# EasyEDA Pro project ProPrj_C64 Printer Interface_2025-09-17.epro

# Schematic Schematic1
Board Name: Board1; Create Date: 2025-08-26; Page Name: P1; Project Name: C64 Printer Interface; Schematic Name: Schematic1; Update Date: 2025-09-10; Company: EasyEDA.com; Page Size: A4; Version: V1.0
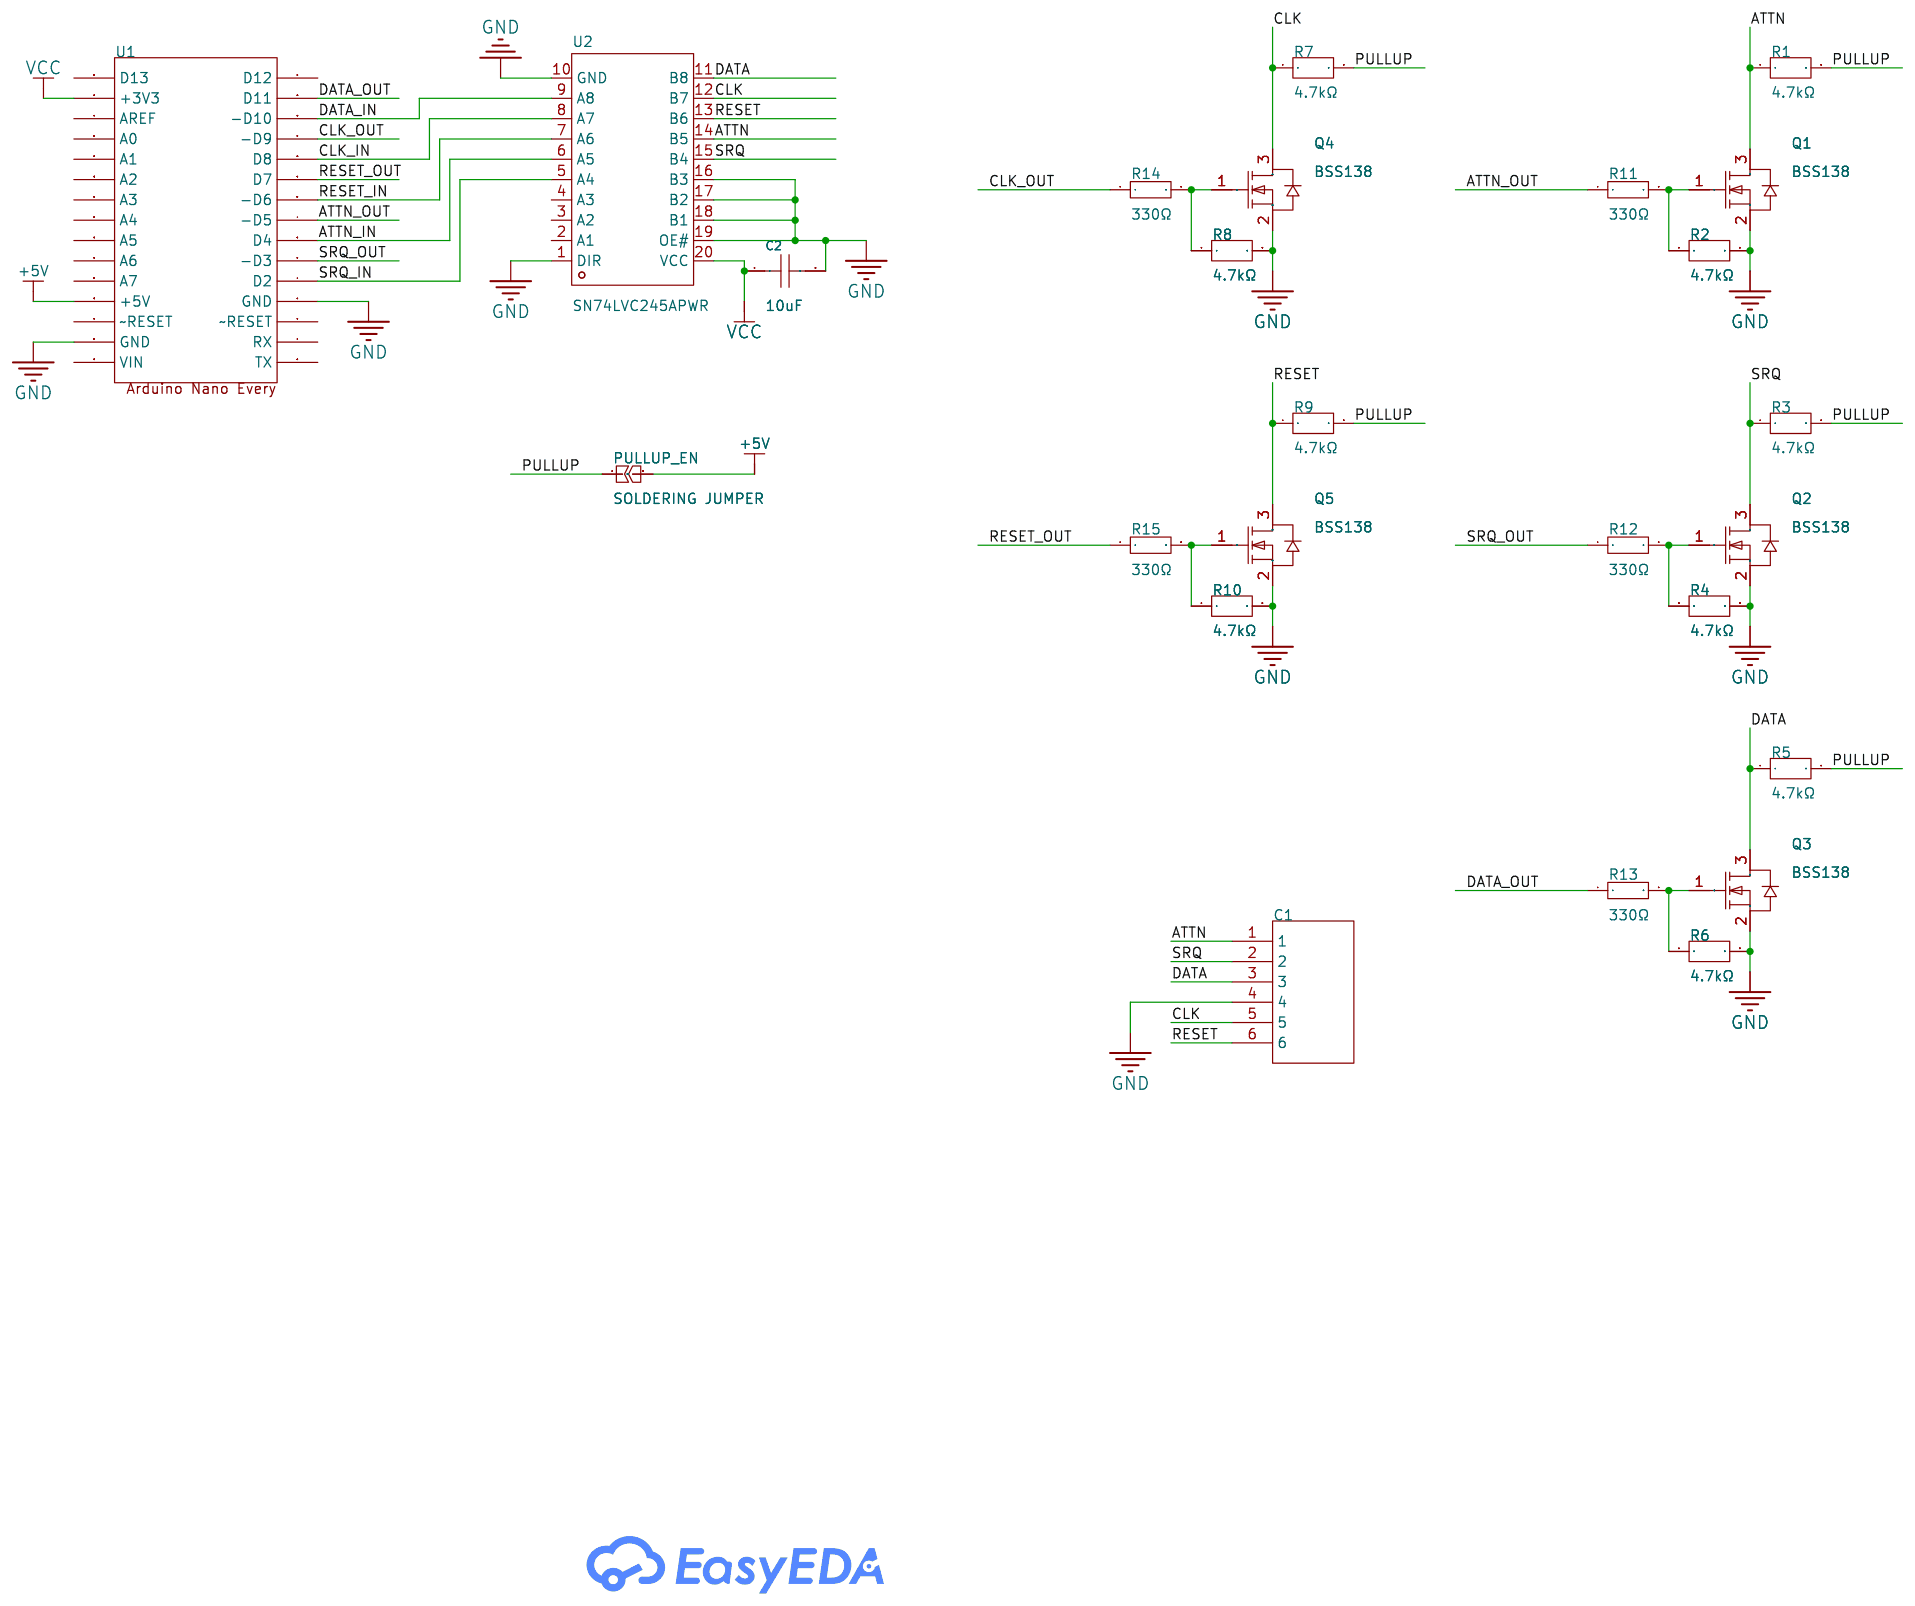
[diagram p0: schematic sheet]

## Parts
C1  DIN 6  [FC680806]
C2  10uF  [C0603]
PULLUP_EN  SOLDERING JUMPER  [JUMPER]
Q1  BSS138  [SOT-23_L2.9-W1.3-P1.90-LS2.4-BR]
Q2  BSS138  [SOT-23_L2.9-W1.3-P1.90-LS2.4-BR]
Q3  BSS138  [SOT-23_L2.9-W1.3-P1.90-LS2.4-BR]
Q4  BSS138  [SOT-23_L2.9-W1.3-P1.90-LS2.4-BR]
Q5  BSS138  [SOT-23_L2.9-W1.3-P1.90-LS2.4-BR]
R1  4.7kΩ  [R0805]
R2  4.7kΩ  [R0805]
R3  4.7kΩ  [R0805]
R4  4.7kΩ  [R0805]
R5  4.7kΩ  [R0805]
R6  4.7kΩ  [R0805]
R7  4.7kΩ  [R0805]
R8  4.7kΩ  [R0805]
R9  4.7kΩ  [R0805]
R10  4.7kΩ  [R0805]
R11  330Ω  [R0603]
R12  330Ω  [R0603]
R13  330Ω  [R0603]
R14  330Ω  [R0603]
R15  330Ω  [R0603]
U1  -  [Arduino Nano Every (SMD)]
U2  SN74LVC245APWR  [TSSOP-20_L6.5-W4.4-P0.65-LS6.4-BL]

## Library data of the parts
C1 = FC680806 DIN 6 240°
C2 = CL10A106MA8NRNC: Capacitance:10uF Tolerance:±20% Tolerance:±20% Voltage Rating:25V Temperature Coefficient:X5R; LCSC Part Name: 10uF ±20% 25V; Supplier Part: C96446; Manufacturer: SAMSUNG(三星); Supplier Footprint: 0603; JLCPCB Part Class: Basic Part; Datasheet: https://item.szlcsc.com/datasheet/CL10A106MA8NRNC/97651.html; Supplier: LCSC; Tolerance: ±20%; Voltage Rating: 25V; Temperature Coefficient: X5R
PULLUP_EN = Jumper 3pin
Q1-Q5 = BSS138_C2938375: Number:1 N-Channel Drain to Source Voltage:50V Current - Continuous Drain(Id):220mA RDS(on):1.7Ω@10V；6Ω@4.5V Pd - Power Dissipation:350mW Gate Threshold Voltage (Vgs(th)):1.5V@1mA Gate Charge(Qg):- Input Capacitance(Ciss):27pF Reverse Transfer Capacitance; LCSC Part Name: 1个N沟道 耐压:50V 电流:220mA; Supplier Part: C2938375; Manufacturer: GOODWORK(固得沃克); Supplier Footprint: SOT-23; JLCPCB Part Class: Extended Part; Datasheet: https://item.szlcsc.com/datasheet/BSS138/3294712.html; Supplier: LCSC; Number: 1 N-Channel; Drain to Source Voltage: 50V; Current - Continuous Drain(Id): 220mA; RDS(on): 1.7Ω@10V；6Ω@4.5V; Pd - Power Dissipation: 350mW; Gate Threshold Voltage (Vgs(th)): 1.5V@1mA; Input Capacitance(Ciss): 27pF; Reverse Transfer Capacitance (Crss@Vds): 6pF; Operating Temperature: -55℃~+150℃@(Tj); Type: N-Channel; Output Capacitance(Coss): 13pF
R1-R10 = ERJ6RBD4701V: Type:Thick Film Resistors Resistance:4.7kΩ Tolerance:±0.5% Tolerance:±0.5% Power(Watts): Overload Voltage (Max): Temperature Coefficient:±50ppm/℃ Temperature Coefficient:±50ppm/℃ Operating Temperature Range:-55℃~+155℃ Operating Temperature Range:-55℃~+155; LCSC Part Name: 4.7kΩ ±0.5% 100mW 厚膜电阻; Supplier Part: C336873; Manufacturer: PANASONIC(松下); Supplier Footprint: 0805; JLCPCB Part Class: Extended Part; Datasheet: https://atta.szlcsc.com/upload/public/pdf/source/20190227/C336873_CFE7B4490CD09E0892B850DE1394AEF8.pdf; Supplier: LCSC; Type: Thick Film Resistors; Tolerance: ±0.5%; Temperature Coefficient: ±50ppm/℃; Operating Temperature Range: -55℃~+155℃
R11-R15 = 0603WAF3300T5E: Type:Thick Film Resistors Resistance: Tolerance:±1% Tolerance:±1% Power(Watts): Overload Voltage (Max): Temperature Coefficient:±100ppm/℃ Temperature Coefficient:±100ppm/℃ Operating Temperature Range:-55℃~+155℃ Operating Temperature Range:-55℃~+155℃; LCSC Part Name: 330Ω ±1% 100mW 厚膜电阻; Supplier Part: C23138; Manufacturer: UNI-ROYAL(厚声); Supplier Footprint: 0603; JLCPCB Part Class: Basic Part; Datasheet: https://atta.szlcsc.com/upload/public/pdf/source/20200306/C422600_1E6D84923E4A46A82E41ADD87F860B5C.pdf; Supplier: LCSC; Type: Thick Film Resistors; Tolerance: ±1%; Temperature Coefficient: ±100ppm/℃; Operating Temperature Range: -55℃~+155℃
U1 = Arduino Nano Every
U2 = SN74LVC245APWR: output type:Tri-State Voltage - Supply:1.65V~3.6V Voltage - Supply:1.65V~3.6V Number of Elements:1 Number of Bits per Element:8 Current - Output Low(IOL):24mA Current - Output High(IOH):24mA Logic Family:74LVC Operating Temperature:-40℃~+125℃ Operating Te; Supplier Part: C7848; Manufacturer: TI(德州仪器); Supplier Footprint: TSSOP-20; JLCPCB Part Class: Extended Part; Datasheet: https://www.ti.com/cn/lit/gpn/sn74lvc245a; Supplier: LCSC; output type: Tri-State; Voltage - Supply: 1.65V~3.6V; Number of Elements: 1; Number of Bits per Element: 8; Current - Output Low(IOL): 24mA; Current - Output High(IOH): 24mA; Logic Family: 74LVC; Operating Temperature: -40℃~+125℃

## Nets
+5V: PULLUP_EN.2 U1.26(+5V)
GND: C1.4 C2.2 Q1.2(S) Q2.2(S) Q3.2(S) Q4.2(S) Q5.2(S) R2.2 R4.2 R6.2 R8.2 R10.2 U1.3(GND) U1.28(GND) U2.1(DIR) U2.10(GND) U2.16(B3) U2.17(B2) U2.18(B1) U2.19(OE#)
VCC: C2.1 U1.16(+3V3) U2.20(VCC)
ATTN: C1.1 Q1.3(D) R1.1 U2.14(B5)
ATTN_IN: U1.6(D4) U2.6(A5)
ATTN_OUT: R11.1 U1.7(-D5)
CLK: C1.5 Q4.3(D) R7.1 U2.12(B7)
CLK_IN: U1.10(D8) U2.8(A7)
CLK_OUT: R14.1 U1.11(-D9)
DATA: C1.3 Q3.3(D) R5.1 U2.11(B8)
DATA_IN: U1.12(-D10) U2.9(A8)
DATA_OUT: R13.1 U1.13(D11)
PULLUP: PULLUP_EN.1 R1.2 R3.2 R5.2 R7.2 R9.2
RESET: C1.6 Q5.3(D) R9.1 U2.13(B6)
RESET_IN: U1.8(-D6) U2.7(A6)
RESET_OUT: R15.1 U1.9(D7)
SRQ: C1.2 Q2.3(D) R3.1 U2.15(B4)
SRQ_IN: U1.4(D2) U2.5(A4)
SRQ_OUT: R12.1 U1.5(-D3)
$1N1789: Q1.1(G) R2.1 R11.2
$1N2403: Q2.1(G) R4.1 R12.2
$1N2692: Q3.1(G) R6.1 R13.2
$1N2981: Q4.1(G) R8.1 R14.2
$1N3270: Q5.1(G) R10.1 R15.2

Not connected (* = marked no-connect by the designer): U1 0(TX) 1(RX) 2(~RESET) 14(D12) 15(D13) 17(AREF) 18(A0) 19(A1) 20(A2) 21(A3) 22(A4) 23(A5) 24(A6) 25(A7) 27(~RESET) 29(VIN); U2 2(A1) 3(A2) 4(A3)

# Board PCB1
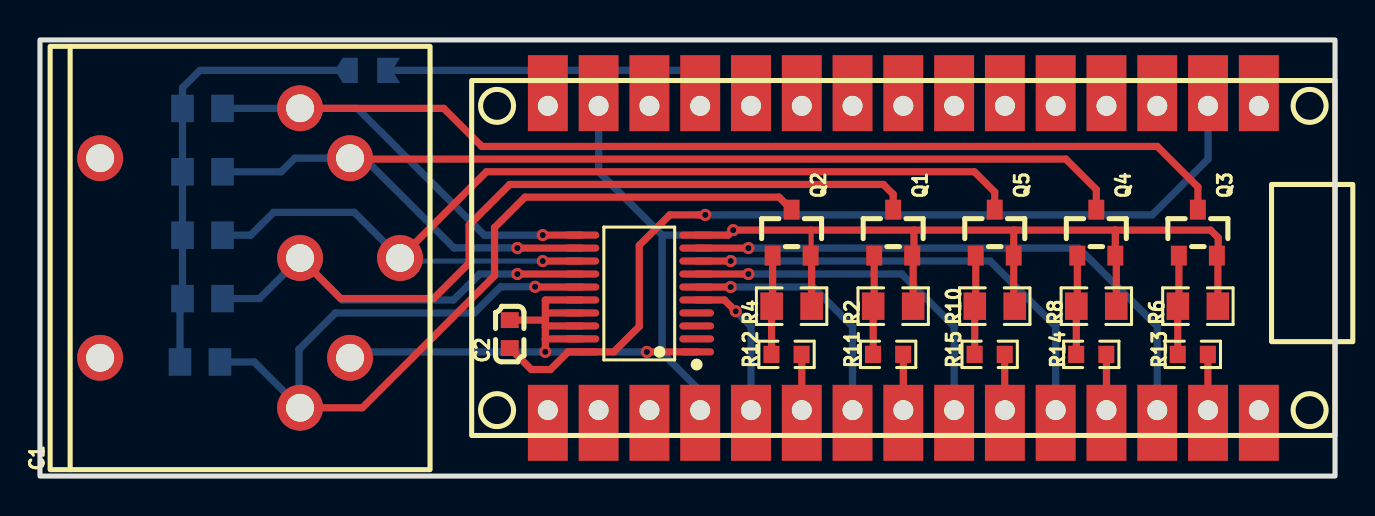
[diagram p1: board, top side]
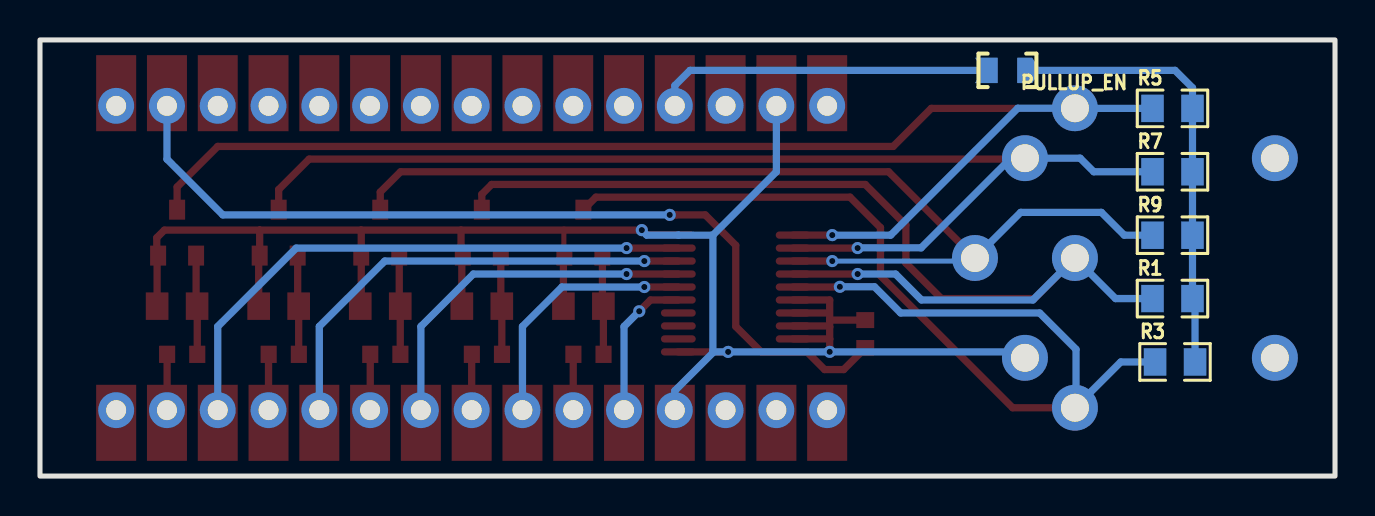
[diagram p2: board, bottom side, seen from below]

Outline 64.77 x 21.84 mm; copper layers: Top Layer, Bottom Layer. Coordinates in mm from the lower left corner of the outline.
Outline path: rectangle 0,21.84 64.77,0
Stack: Top Layer 0.035mm / Dielectric1 1.51mm FR4 er 4.5 / Bottom Layer 0.035mm

## Design rules (mm)
template: JLCPCB Capability(Two Layers Board)
spacing copperThickness1oz (default): track to track 0.102, other pairs 0.152 to 0.3
spacing copperThickness2oz: track to track 0.203, other pairs 0.152 to 0.3
track width copperThickness1oz (default): min 0.127, default 0.254, max 2.54
track width copperThickness2oz: min 0.203, default 0.254, max 2.54
differential pair differentialPair (default): width min 0.127, default 0.254, max 2.54; gap min 0.152, default 0.152
via viaSize (default): diameter min 0.5, default 0.61, max 10; hole min 0.3, default 0.305, max 6.3

## Placement (name value [footprint] x y rotation side)
C1  DIN 6  [FC680806]  0.51 10.92 90 top
C2  10uF  [C0603]  23.5 7.11 90 top
PULLUP_EN  SOLDERING JUMPER  [JUMPER]  17.65 20.32 0 bottom
Q1  BSS138  [SOT-23_L2.9-W1.3-P1.90-LS2.4-BR]  42.67 12.19 270 top
Q2  BSS138  [SOT-23_L2.9-W1.3-P1.90-LS2.4-BR]  37.59 12.19 270 top
Q3  BSS138  [SOT-23_L2.9-W1.3-P1.90-LS2.4-BR]  57.91 12.19 270 top
Q4  BSS138  [SOT-23_L2.9-W1.3-P1.90-LS2.4-BR]  52.83 12.19 270 top
Q5  BSS138  [SOT-23_L2.9-W1.3-P1.90-LS2.4-BR]  47.75 12.19 270 top
R1  4.7kΩ  [R0805]  8.13 8.89 180 bottom
R2  4.7kΩ  [R0805]  42.67 8.51 0 top
R3  4.7kΩ  [R0805]  8 5.71 180 bottom
R4  4.7kΩ  [R0805]  37.59 8.51 0 top
R5  4.7kΩ  [R0805]  8.13 18.41 180 bottom
R6  4.7kΩ  [R0805]  57.91 8.51 0 top
R7  4.7kΩ  [R0805]  8.13 15.24 180 bottom
R8  4.7kΩ  [R0805]  52.83 8.51 0 top
R9  4.7kΩ  [R0805]  8.13 12.06 180 bottom
R10  4.7kΩ  [R0805]  47.75 8.51 0 top
R11  330Ω  [R0603]  42.42 6.1 180 top
R12  330Ω  [R0603]  37.34 6.1 180 top
R13  330Ω  [R0603]  57.66 6.1 180 top
R14  330Ω  [R0603]  52.58 6.1 180 top
R15  330Ω  [R0603]  47.5 6.1 180 top
U1  -  [Arduino Nano Every (SMD)]  43.18 10.92 180 top
U2  SN74LVC245APWR  [TSSOP-20_L6.5-W4.4-P0.65-LS6.4-BL]  29.97 9.14 90 top

## Footprints (pads in the part's own frame, mm; a bottom-side part is the same pattern mirrored in y, then rotated)
Arduino Nano Every (SMD)
  rect 2x3.81 smd: 0(17.78,8.255) 1(15.24,8.255) 2(12.7,8.255) 3(10.16,8.255) 4(7.62,8.255) 5(5.08,8.255) 6(2.54,8.255) 7(0,8.255) 8(-2.54,8.255) 9(-5.08,8.255) 10(-7.62,8.255) 11(-10.16,8.255) 12(-12.7,8.255) 13(-15.24,8.255) 14(-17.78,8.255) 15(-17.78,-8.255) 16(-15.24,-8.255) 17(-12.7,-8.255) 18(-10.16,-8.255) 19(-7.62,-8.255) 20(-5.08,-8.255) 21(-2.54,-8.255) 22(0,-8.255) 23(2.54,-8.255) 24(5.08,-8.255) 25(7.62,-8.255) 26(10.16,-8.255) 27(12.7,-8.255) 28(15.24,-8.255) 29(17.78,-8.255)
  round 1.8 hole 1: 0(17.78,7.62) 1(15.24,7.62) 2(12.7,7.62) 3(10.16,7.62) 4(7.62,7.62) 5(5.08,7.62) 6(2.54,7.62) 7(0,7.62) 8(-2.54,7.62) 9(-5.08,7.62) 10(-7.62,7.62) 11(-10.16,7.62) 12(-12.7,7.62) 13(-15.24,7.62) 14(-17.78,7.62) 15(-17.78,-7.62) 16(-15.24,-7.62) 17(-12.7,-7.62) 18(-10.16,-7.62) 19(-7.62,-7.62) 20(-5.08,-7.62) 21(-2.54,-7.62) 22(0,-7.62) 23(2.54,-7.62) 24(5.08,-7.62) 25(7.62,-7.62) 26(10.16,-7.62) 27(12.7,-7.62) 28(15.24,-7.62) 29(17.78,-7.62)
C0603
  rect 0.8x0.9 smd: 1(-0.7,0) 2(0.7,0)
FC680806
  round 2.3 hole 1.4: 1(0,-12.5) 2(-7.5,-12.5) 3(7.5,-12.5) 4(-5,-15) 5(5,-15) 6(0,-17.5) 7(-5,-2.5) 8(5,-2.5)
JUMPER
  custom 1.143x1.27 smd: 1(-2.134,0) 2(-0.406,0)
R0603
  rect 0.806x0.864 smd: 1(-0.753,0) 2(0.753,0)
R0805
  rect 1.133x1.377 smd: 1(-1,0) 2(1,0)
SOT-23_L2.9-W1.3-P1.90-LS2.4-BR
  rect 1x0.8 smd: 1(1.15,-0.95) 2(1.15,0.95) 3(-1.15,0)
TSSOP-20_L6.5-W4.4-P0.65-LS6.4-BL
  oval 0.364x1.742 smd: 1(-2.925,-2.871) 2(-2.275,-2.871) 3(-1.625,-2.871) 4(-0.975,-2.871) 5(-0.325,-2.871) 6(0.325,-2.871) 7(0.975,-2.871) 8(1.625,-2.871) 9(2.275,-2.871) 10(2.925,-2.871) 11(2.925,2.871) 12(2.275,2.871) 13(1.625,2.871) 14(0.975,2.871) 15(0.325,2.871) 16(-0.325,2.871) 17(-0.975,2.871) 18(-1.625,2.871) 19(-2.275,2.871) 20(-2.925,2.871)

## Nets
As in the schematic.

Pads without a net: C1 7 8; U1 0 1 2 14 15 17 18 19 20 21 22 23 24 25 27 29; U2 2 3 4

## Via types
v1: diameter 0.61, hole 0.305, Top Layer to Bottom Layer, 14 vias

## Routing (per net, layer and track width the routed paths; a pad name or vN(x,y) marks a point on that pad's centre or on a via; arc(x,y) is an arc through that point)
+5V: length 17.1
  Bottom Layer w0.364: PULLUP_EN.2 32.26,20.32 33.02,19.56 U1.26
GND: length 96.1
  Top Layer w0.254: Q2.2 38.57,11.07 38.57,12.32
  Top Layer w0.364: R4.2 38.59,10.99 Q2.2 ; 43.71,12.32 48.71,12.32 ; 43.71,12.32 43.71,11.13 Q1.2 43.67,10.99 R2.2 ; 43.71,12.32 v1(34.67,12.32) 34.42,12.07 U2.10 ; 48.71,12.32 53.78,12.32 ; 48.71,12.32 48.7,12.31 Q5.2 48.7,8.56 R10.2 ; 25.27,7.81 25.27,8.82 27.1,8.82 ; 25.27,7.81 25.27,7.47 ; 25.27,7.81 25.27,7.81 C2.2 ; U2.1 v1(30.35,6.22) ; 25.27,6.86 25.28,6.87 27.1,6.87 ; 25.27,6.86 25.27,7.47 ; 25.27,6.86 v1(25.27,6.22) ; 53.78,12.32 58.55,12.32 58.93,11.94 58.93,11.11 Q3.2 58.91,10.99 R6.2 ; 53.78,12.32 53.78,12.32 Q4.2 53.83,10.99 R8.2 ; 25.27,7.47 25.32,7.52 27.1,7.52 ; 27.1,8.17 25.31,8.17
  Bottom Layer w0.254: v1(25.27,6.22) 25.27,6.22
  Bottom Layer w0.364: 31.11,12.06 27.94,15.24 U1.28 ; 31.11,12.06 31.11,6.26 31.07,6.22 ; 31.11,12.06 32.84,12.06 U2.10 34.42,12.07 v1(34.67,12.32) ; U1.3 33.02,4.27 31.07,6.22 ; 31.07,6.22 v1(30.35,6.22) 15.8,6.22 C1.4
VCC: length 44.8
  Top Layer w0.364: C2.1 24.57,5.33 25.53,5.33 26.41,6.22 28.7,6.22 29.97,7.49 29.97,11.56 31.5,13.08 v1(33.27,13.08)
  Bottom Layer w0.364: v1(33.27,13.08) 55.63,13.08 58.42,15.88 U1.16
ATTN: length 55.2
  Top Layer w0.364: 27.1,10.12 v1(23.88,10.12) ; C1.1 15.04,8.89 19.69,8.89 21.46,10.67 21.46,12.57 23.5,14.6 42.18,14.6 42.67,14.11 Q1.3
  Bottom Layer w0.364: R1.1 10.98,8.89 C1.1 15.11,8.82 20.68,8.82 21.98,10.12 v1(23.88,10.12)
ATTN_IN: length 12.8
  Top Layer w0.364: U2.6 v1(34.54,9.47)
  Bottom Layer w0.364: U1.6 40.64,7.49 38.66,9.47 v1(34.54,9.47)
ATTN_OUT: length 2.8
  Top Layer w0.364: R11.1 43.18,6.09 U1.7
CLK: length 59.1
  Top Layer w0.364: C1.5 15.55,15.88 51.31,15.88 52.83,14.35 Q4.3 ; 27.1,11.42 v1(23.88,11.42)
  Bottom Layer w0.254: v1(23.88,11.42) 23.86,11.43
  Bottom Layer w0.364: R7.1 12.07,15.24 12.75,15.92 16.21,15.92 20.7,11.43 23.86,11.43
CLK_IN: length 23.5
  Top Layer w0.364: U2.8 v1(34.54,10.77)
  Bottom Layer w0.364: U1.10 50.8,7.49 47.52,10.77 v1(34.54,10.77)
CLK_OUT: length 2.8
  Top Layer w0.364: U1.11 53.34,6.09 R14.1
DATA: length 68.3
  Top Layer w0.364: 27.1,12.07 v1(25.15,12.07) ; Q3.3 57.91,14.48 55.88,16.51 22.1,16.51 20.19,18.41 13.02,18.41 C1.3
  Bottom Layer w0.254: v1(25.15,12.07) 25.14,12.06
  Bottom Layer w0.364: R5.1 13,18.41 C1.3 15.87,18.42 22.23,12.06 25.14,12.06
DATA_IN: length 28.9
  Top Layer w0.364: U2.9 v1(35.43,11.42)
  Bottom Layer w0.364: U1.12 55.88,7.49 51.95,11.42 v1(35.43,11.42)
DATA_OUT: length 2.8
  Top Layer w0.364: R13.1 58.41,3.31 U1.13
PULLUP: length 22.5
  Bottom Layer w0.364: PULLUP_EN.1 8,20.32 7.13,19.45 R5.2 R7.2 R9.2 R1.2 7,8.76 R3.2
RESET: length 52.3
  Top Layer w0.364: Q5.3 47.75,14.22 46.74,15.24 22.33,15.24 C1.6 ; 27.1,10.77 v1(25.15,10.77)
  Bottom Layer w0.254: v1(25.15,10.77) 18.16,10.77 C1.6
  Bottom Layer w0.364: R9.1 10.54,12.06 11.68,13.21 15.72,13.21 C1.6
RESET_IN: length 18.2
  Top Layer w0.364: 32.84,10.12 v1(35.43,10.12)
  Bottom Layer w0.364: U1.8 45.72,7.49 43.09,10.12 v1(35.43,10.12)
RESET_OUT: length 2.8
  Top Layer w0.364: U1.9 48.25,3.31 R15.1
SRQ: length 53.8
  Top Layer w0.364: 27.1,9.47 24.78,9.47 v1(24.77,9.48) ; C1.2 16.12,3.42 22.73,10.03 22.73,12.45 24.26,13.97 36.96,13.97 Q2.3
  Bottom Layer w0.364: R3.1 10.72,5.71 12.95,3.48 12.95,6.35 14.77,8.17 21.72,8.17 23.03,9.48 v1(24.77,9.48)
SRQ_IN: length 7.5
  Top Layer w0.364: U2.5 34.23,8.82 v1(34.8,8.25)
  Bottom Layer w0.364: U1.4 35.56,7.49 v1(34.8,8.25)
SRQ_OUT: length 2.8
  Top Layer w0.364: R12.1 38.1,6.09 U1.5
$1N1789: length 5
  Top Layer w0.364: Q1.1 41.72,8.56 R2.1 41.67,6.1 R11.2
$1N2403: length 5
  Top Layer w0.364: R12.2 36.59,6.1 R4.1 36.64,8.56 Q2.1
$1N2692: length 5
  Top Layer w0.364: R6.1 56.96,8.56 Q3.1 ; R13.2 56.9,8.5
$1N2981: length 5
  Top Layer w0.364: Q4.1 51.88,8.56 R8.1 51.83,6.1 R14.2
$1N3270: length 5
  Top Layer w0.364: Q5.1 46.8,8.56 R10.1 46.75,6.1 R15.2
